# EAGLE design ProtoStar v1 (EAGLE 5.11)
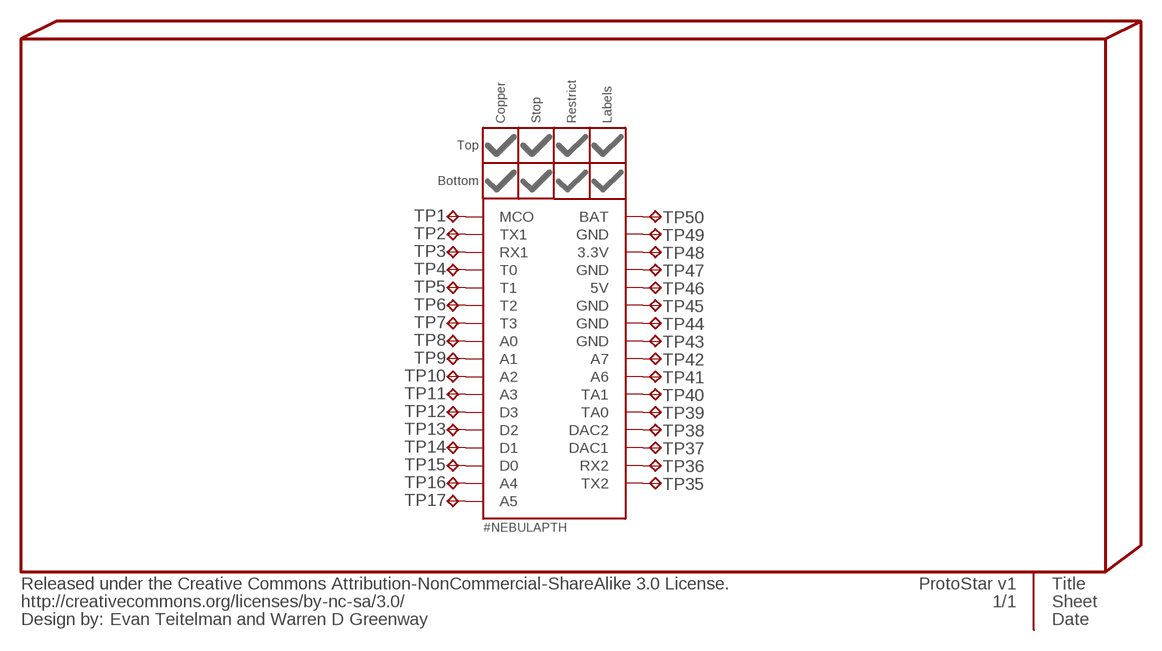
[diagram p0: schematic, sheet 1]

## Parts
FP1  #NEBULAPTH  [#NEBULA-PTH]
INFO2  Evan Teitelman and Warren D Greenway  %CC-NC-SA  [%CC-NC-SA]
TP1  NEBULA-TP  [NEBULA-TP]
TP2  NEBULA-TP  [NEBULA-TP]
TP3  NEBULA-TP  [NEBULA-TP]
TP4  NEBULA-TP  [NEBULA-TP]
TP5  NEBULA-TP  [NEBULA-TP]
TP6  NEBULA-TP  [NEBULA-TP]
TP7  NEBULA-TP  [NEBULA-TP]
TP8  NEBULA-TP  [NEBULA-TP]
TP9  NEBULA-TP  [NEBULA-TP]
TP10  NEBULA-TP  [NEBULA-TP]
TP11  NEBULA-TP  [NEBULA-TP]
TP12  NEBULA-TP  [NEBULA-TP]
TP13  NEBULA-TP  [NEBULA-TP]
TP14  NEBULA-TP  [NEBULA-TP]
TP15  NEBULA-TP  [NEBULA-TP]
TP16  NEBULA-TP  [NEBULA-TP]
TP17  NEBULA-TP  [NEBULA-TP]
TP35  NEBULA-TP  [NEBULA-TP]
TP36  NEBULA-TP  [NEBULA-TP]
TP37  NEBULA-TP  [NEBULA-TP]
TP38  NEBULA-TP  [NEBULA-TP]
TP39  NEBULA-TP  [NEBULA-TP]
TP40  NEBULA-TP  [NEBULA-TP]
TP41  NEBULA-TP  [NEBULA-TP]
TP42  NEBULA-TP  [NEBULA-TP]
TP43  NEBULA-TP  [NEBULA-TP]
TP44  NEBULA-TP  [NEBULA-TP]
TP45  NEBULA-TP  [NEBULA-TP]
TP46  NEBULA-TP  [NEBULA-TP]
TP47  NEBULA-TP  [NEBULA-TP]
TP48  NEBULA-TP  [NEBULA-TP]
TP49  NEBULA-TP  [NEBULA-TP]
TP50  NEBULA-TP  [NEBULA-TP]

## Nets
N$226: FP1.MCO TP1.P$1(TP)
N$227: FP1.COM1_TX(TX1) TP2.P$1(TP)
N$228: FP1.COM1_RX(RX1) TP3.P$1(TP)
N$229: FP1.T0 TP4.P$1(TP)
N$230: FP1.T1 TP5.P$1(TP)
N$231: FP1.T2 TP6.P$1(TP)
N$232: FP1.T3 TP7.P$1(TP)
N$233: FP1.A0 TP8.P$1(TP)
N$234: FP1.A1 TP9.P$1(TP)
N$235: FP1.A2 TP10.P$1(TP)
N$236: FP1.A3 TP11.P$1(TP)
N$237: FP1.D3 TP12.P$1(TP)
N$238: FP1.D2 TP13.P$1(TP)
N$239: FP1.D1 TP14.P$1(TP)
N$240: FP1.D0 TP15.P$1(TP)
N$241: FP1.A4 TP16.P$1(TP)
N$242: FP1.A5 TP17.P$1(TP)
N$243: FP1.COM2_TX(TX2) TP35.P$1(TP)
N$244: FP1.COM2_RX(RX2) TP36.P$1(TP)
N$245: FP1.DAC1 TP37.P$1(TP)
N$246: FP1.DAC2 TP38.P$1(TP)
N$247: FP1.TA0 TP39.P$1(TP)
N$248: FP1.TA1 TP40.P$1(TP)
N$249: FP1.A6 TP41.P$1(TP)
N$250: FP1.A7 TP42.P$1(TP)
N$251: FP1.GND5(GND) TP43.P$1(TP)
N$252: FP1.GND4(GND) TP44.P$1(TP)
N$253: FP1.GND3(GND) TP45.P$1(TP)
N$254: FP1.5V TP46.P$1(TP)
N$255: FP1.GND2(GND) TP47.P$1(TP)
N$256: FP1.3.3V TP48.P$1(TP)
N$257: FP1.GND1(GND) TP49.P$1(TP)
N$258: FP1.BAT TP50.P$1(TP)

## Library data of the parts
FP1 = PygmyBoards:#NEBULA: Nebula Board and Shield Footprint Pads This is the only absolutely required part for the footprint. The parts in "#NEBULA-PART" are merely aesthetic. A circular board outline should be .001" thick and 1.005" in diameter (Reference circle on the Document (48) layer provided).
INFO2 = PygmyBoards:%CC-NC-SA: Released under the Creative Commons Attribution-NonCommercial-ShareAlike 3.0 License. http://creativecommons.org/licenses/by-sa/3.0 Design by: [Designer Name] Change this part's value to change the designer name
TP1-TP17 TP35-TP50 = Pygmy:NEBULA-TP

## Board
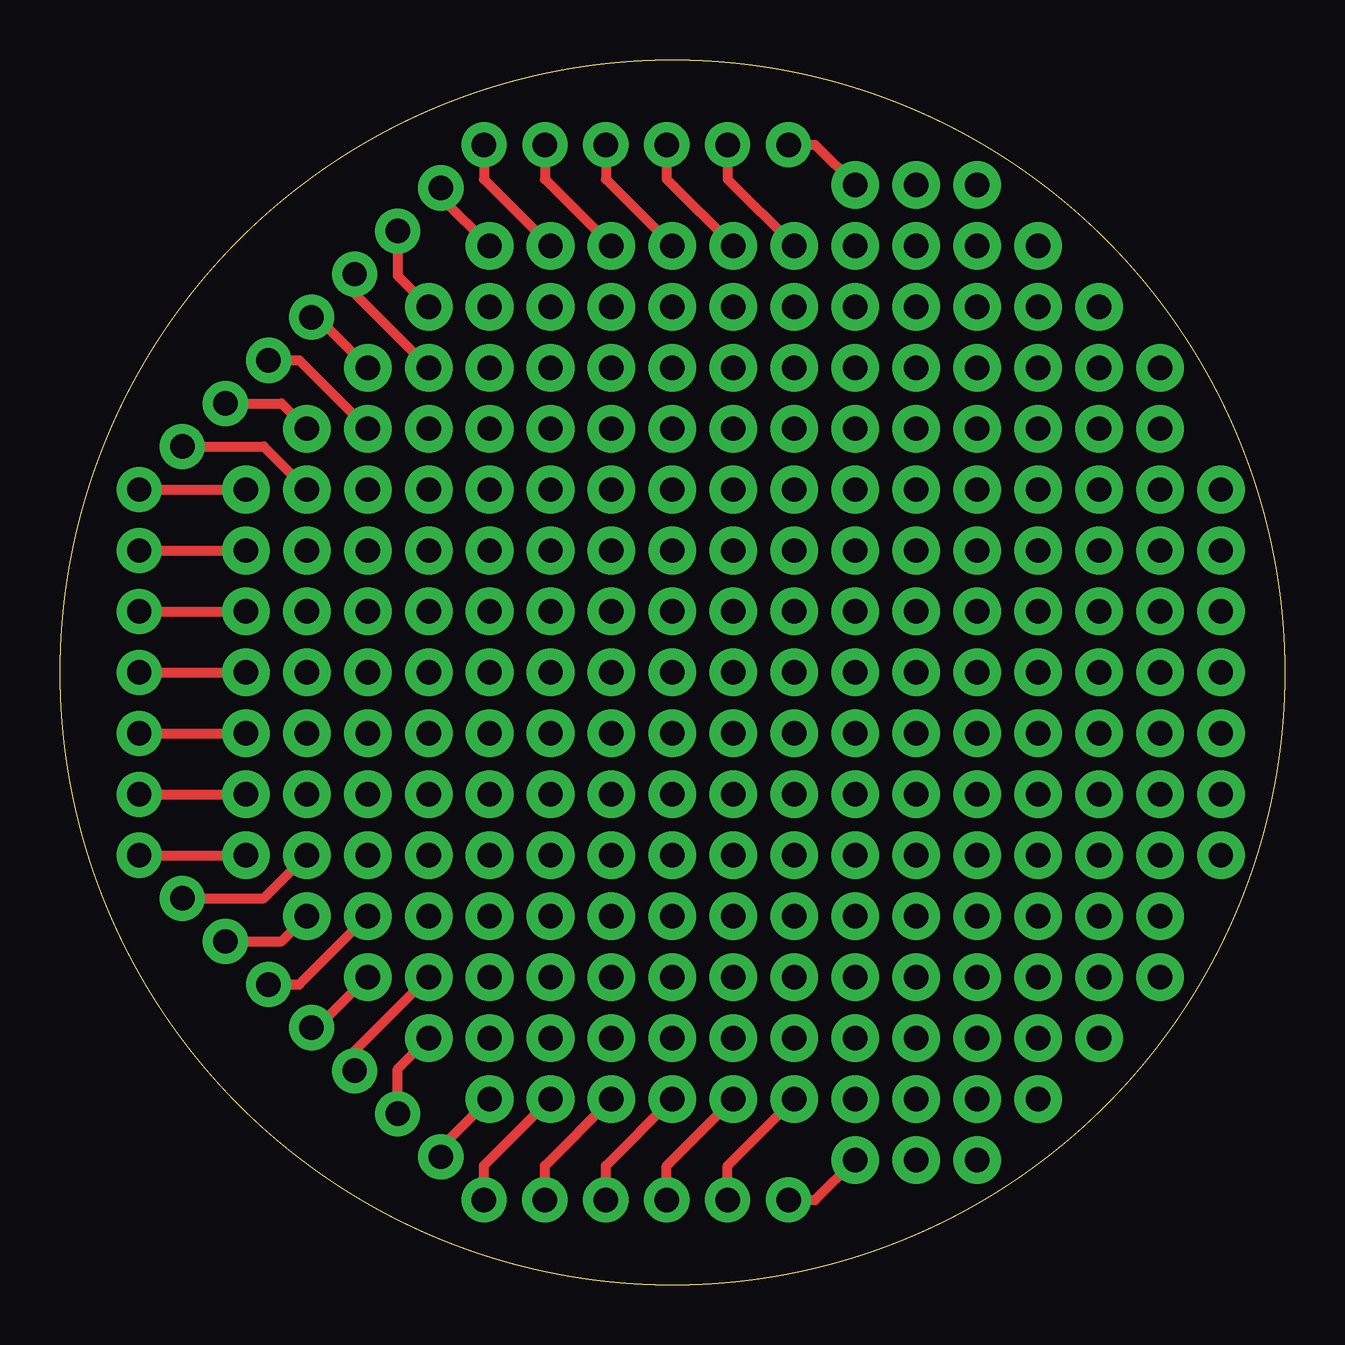
[diagram p1: board, top side]

Size 51.05 x 51.05 mm. Coordinates in mm from the lower left corner, seen from the top.
Outline: circle at 25.53,25.53 radius 25.53
Copper layers (1*16): Top 0.035mm / dielectric 1.5mm / Bottom 0.035mm
Design rules "PDX (Production)": minimum track width 6mil, minimum drill 15mil, track to track 6mil, track to pad 6mil, pad to pad 4mil, via to via 6mil, smd to smd 4mil, copper to edge 15mil, drill to drill 6mil, minimum pad ring 10mil, minimum via ring 8mil, stop-mask expansion 4mil, vias tented up to drill 25mil, thermal gap 10mil

### Footprints (pad centres in the part's own frame; a part is rotated, then mirrored left to right if it is on the bottom)
#NEBULA-PTH = drill 1.016 pad 1.88 round: 3.3V -25.637,-47.388; 5V -30.716,-47.388; A0 -36.848,-7.004; A1 -38.645,-8.8; A2 -40.44,-10.596; A3 -42.237,-12.392; A4 -47.625,-22.86; A5 -47.625,-25.4; A6 -40.44,-40.204; A7 -38.645,-42; BAT -20.557,-47.388; COM1_RX -25.636,-3.412; COM1_TX -23.096,-3.412; COM2_RX -47.625,-30.48; COM2_TX -47.625,-27.94; D0 -47.625,-20.32; D1 -47.625,-17.78; D2 -45.829,-15.984; D3 -44.032,-14.188; DAC1 -47.625,-33.02; DAC2 -45.829,-34.816; GND1 -36.848,-43.796; GND2 -35.052,-45.592; GND3 -33.256,-47.388; GND4 -28.177,-47.388; GND5 -23.097,-47.388; MCO -20.556,-3.412; T0 -28.176,-3.412; T1 -30.716,-3.412; T2 -33.256,-3.412; T3 -35.052,-5.208; TA0 -44.032,-36.612; TA1 -42.237,-38.408
NEBULA-TP = drill 1.016 pad 1.981 round: P$1 0,0

### Placement (x,y rotation side)
FP1  50.93,50.93 0 top
INFO2  -2.41,-10.03 0 top  (outside the outline)
TP1  33.15,45.85 0 top
TP2  30.61,43.31 0 top
TP3  28.07,43.31 0 top
TP4  25.53,43.31 0 top
TP5  22.99,43.31 0 top
TP6  20.45,43.31 0 top
TP7  17.91,43.31 0 top
TP8  15.37,40.77 0 top
TP9  15.37,38.23 0 top
TP10  12.83,38.23 0 top
TP11  12.83,35.69 0 top
TP12  10.29,35.69 0 top
TP13  10.29,33.15 0 top
TP14  7.75,33.15 0 top
TP15  7.75,30.61 0 top
TP16  7.75,28.07 0 top
TP17  7.75,25.53 0 top
TP35  7.75,22.99 0 top
TP36  7.75,20.45 0 top
TP37  7.75,17.91 0 top
TP38  10.29,17.91 0 top
TP39  10.29,15.37 0 top
TP40  12.83,15.37 0 top
TP41  12.83,12.83 0 top
TP42  15.37,12.83 0 top
TP43  30.61,7.75 0 top
TP44  25.53,7.75 0 top
TP45  20.45,7.75 0 top
TP46  22.99,7.75 0 top
TP47  17.91,7.75 0 top
TP48  28.07,7.75 0 top
TP49  15.37,10.29 0 top
TP50  33.15,5.21 0 top

### Tracks (layer width: path | path; a pad name or v marks a point on that pad's centre or on a via)
N$1  (via drill 1.02 pad 1.98)
  other vias: 40.77,7.75
N$2  (via drill 1.02 pad 1.98)
  other vias: 40.77,10.29
N$3  (via drill 1.02 pad 1.98)
  other vias: 40.77,12.83
N$4  (via drill 1.02 pad 1.98)
  other vias: 40.77,15.37
N$5  (via drill 1.02 pad 1.98)
  other vias: 40.77,17.91
N$6  (via drill 1.02 pad 1.98)
  other vias: 40.77,20.45
N$7  (via drill 1.02 pad 1.98)
  other vias: 40.77,22.99
N$8  (via drill 1.02 pad 1.98)
  other vias: 40.77,25.53
N$9  (via drill 1.02 pad 1.98)
  other vias: 40.77,43.31
N$10  (via drill 1.02 pad 1.98)
  other vias: 40.77,40.77
N$11  (via drill 1.02 pad 1.98)
  other vias: 40.77,38.23
N$12  (via drill 1.02 pad 1.98)
  other vias: 40.77,35.69
N$13  (via drill 1.02 pad 1.98)
  other vias: 40.77,33.15
N$14  (via drill 1.02 pad 1.98)
  other vias: 40.77,30.61
N$15  (via drill 1.02 pad 1.98)
  other vias: 40.77,28.07
N$16  (via drill 1.02 pad 1.98)
  other vias: 38.23,40.77
N$17  (via drill 1.02 pad 1.98)
  other vias: 38.23,38.23
N$18  (via drill 1.02 pad 1.98)
  other vias: 38.23,35.69
N$19  (via drill 1.02 pad 1.98)
  other vias: 38.23,33.15
N$20  (via drill 1.02 pad 1.98)
  other vias: 38.23,30.61
N$21  (via drill 1.02 pad 1.98)
  other vias: 38.23,28.07
N$22  (via drill 1.02 pad 1.98)
  other vias: 38.23,7.75
N$23  (via drill 1.02 pad 1.98)
  other vias: 38.23,10.29
N$24  (via drill 1.02 pad 1.98)
  other vias: 38.23,12.83
N$25  (via drill 1.02 pad 1.98)
  other vias: 38.23,15.37
N$26  (via drill 1.02 pad 1.98)
  other vias: 38.23,17.91
N$27  (via drill 1.02 pad 1.98)
  other vias: 38.23,20.45
N$28  (via drill 1.02 pad 1.98)
  other vias: 38.23,22.99
N$29  (via drill 1.02 pad 1.98)
  other vias: 38.23,25.53
N$30  (via drill 1.02 pad 1.98)
  other vias: 35.69,40.77
N$31  (via drill 1.02 pad 1.98)
  other vias: 35.69,38.23
N$32  (via drill 1.02 pad 1.98)
  other vias: 35.69,35.69
N$33  (via drill 1.02 pad 1.98)
  other vias: 35.69,33.15
N$34  (via drill 1.02 pad 1.98)
  other vias: 35.69,30.61
N$35  (via drill 1.02 pad 1.98)
  other vias: 35.69,5.21
N$36  (via drill 1.02 pad 1.98)
  other vias: 35.69,10.29
N$37  (via drill 1.02 pad 1.98)
  other vias: 35.69,12.83
N$38  (via drill 1.02 pad 1.98)
  other vias: 35.69,15.37
N$39  (via drill 1.02 pad 1.98)
  other vias: 10.29,28.07
N$40  (via drill 1.02 pad 1.98)
  other vias: 35.69,20.45
N$41  (via drill 1.02 pad 1.98)
  other vias: 35.69,22.99
N$42  (via drill 1.02 pad 1.98)
  other vias: 35.69,25.53
N$43  (via drill 1.02 pad 1.98)
  other vias: 35.69,28.07
N$44  (via drill 1.02 pad 1.98)
  other vias: 33.15,40.77
N$45  (via drill 1.02 pad 1.98)
  other vias: 33.15,38.23
N$46  (via drill 1.02 pad 1.98)
  other vias: 33.15,35.69
N$47  (via drill 1.02 pad 1.98)
  other vias: 33.15,33.15
N$48  (via drill 1.02 pad 1.98)
  other vias: 33.15,7.75
N$49  (via drill 1.02 pad 1.98)
  other vias: 33.15,10.29
N$50  (via drill 1.02 pad 1.98)
  other vias: 33.15,12.83
N$51  (via drill 1.02 pad 1.98)
  other vias: 33.15,15.37
N$52  (via drill 1.02 pad 1.98)
  other vias: 33.15,17.91
N$53  (via drill 1.02 pad 1.98)
  other vias: 33.15,20.45
N$54  (via drill 1.02 pad 1.98)
  other vias: 33.15,22.99
N$55  (via drill 1.02 pad 1.98)
  other vias: 33.15,25.53
N$56  (via drill 1.02 pad 1.98)
  other vias: 33.15,30.61
N$57  (via drill 1.02 pad 1.98)
  other vias: 33.15,28.07
N$58  (via drill 1.02 pad 1.98)
  other vias: 10.29,20.45
N$59  (via drill 1.02 pad 1.98)
  other vias: 30.61,38.23
N$60  (via drill 1.02 pad 1.98)
  other vias: 30.61,35.69
N$61  (via drill 1.02 pad 1.98)
  other vias: 25.53,15.37
N$62  (via drill 1.02 pad 1.98)
  other vias: 12.83,17.91
N$63  (via drill 1.02 pad 1.98)
  other vias: 30.61,12.83
N$64  (via drill 1.02 pad 1.98)
  other vias: 30.61,15.37
N$65  (via drill 1.02 pad 1.98)
  other vias: 30.61,17.91
N$66  (via drill 1.02 pad 1.98)
  other vias: 30.61,20.45
N$67  (via drill 1.02 pad 1.98)
  other vias: 30.61,22.99
N$68  (via drill 1.02 pad 1.98)
  other vias: 30.61,25.53
N$69  (via drill 1.02 pad 1.98)
  other vias: 30.61,33.15
N$70  (via drill 1.02 pad 1.98)
  other vias: 30.61,30.61
N$71  (via drill 1.02 pad 1.98)
  other vias: 30.61,28.07
N$72  (via drill 1.02 pad 1.98)
  other vias: 28.07,38.23
N$73  (via drill 1.02 pad 1.98)
  other vias: 28.07,35.69
N$74  (via drill 1.02 pad 1.98)
  other vias: 15.37,15.37
N$75  (via drill 1.02 pad 1.98)
  other vias: 28.07,12.83
N$76  (via drill 1.02 pad 1.98)
  other vias: 28.07,15.37
N$77  (via drill 1.02 pad 1.98)
  other vias: 28.07,17.91
N$78  (via drill 1.02 pad 1.98)
  other vias: 28.07,20.45
N$79  (via drill 1.02 pad 1.98)
  other vias: 28.07,22.99
N$80  (via drill 1.02 pad 1.98)
  other vias: 28.07,25.53
N$81  (via drill 1.02 pad 1.98)
  other vias: 28.07,33.15
N$82  (via drill 1.02 pad 1.98)
  other vias: 28.07,30.61
N$83  (via drill 1.02 pad 1.98)
  other vias: 28.07,28.07
N$84  (via drill 1.02 pad 1.98)
  other vias: 25.53,35.69
N$85  (via drill 1.02 pad 1.98)
  other vias: 25.53,33.15
N$86  (via drill 1.02 pad 1.98)
  other vias: 25.53,30.61
N$87  (via drill 1.02 pad 1.98)
  other vias: 25.53,17.91
N$88  (via drill 1.02 pad 1.98)
  other vias: 25.53,20.45
N$89  (via drill 1.02 pad 1.98)
  other vias: 25.53,22.99
N$90  (via drill 1.02 pad 1.98)
  other vias: 25.53,25.53
N$91  (via drill 1.02 pad 1.98)
  other vias: 25.53,28.07
N$92  (via drill 1.02 pad 1.98)
  other vias: 22.99,35.69
N$93  (via drill 1.02 pad 1.98)
  other vias: 22.99,33.15
N$94  (via drill 1.02 pad 1.98)
  other vias: 22.99,30.61
N$95  (via drill 1.02 pad 1.98)
  other vias: 22.99,28.07
N$96  (via drill 1.02 pad 1.98)
  other vias: 22.99,15.37
N$97  (via drill 1.02 pad 1.98)
  other vias: 22.99,17.91
N$98  (via drill 1.02 pad 1.98)
  other vias: 22.99,20.45
N$99  (via drill 1.02 pad 1.98)
  other vias: 22.99,22.99
N$100  (via drill 1.02 pad 1.98)
  other vias: 22.99,25.53
N$101  (via drill 1.02 pad 1.98)
  other vias: 20.45,35.69
N$102  (via drill 1.02 pad 1.98)
  other vias: 20.45,33.15
N$103  (via drill 1.02 pad 1.98)
  other vias: 20.45,30.61
N$104  (via drill 1.02 pad 1.98)
  other vias: 20.45,28.07
N$105  (via drill 1.02 pad 1.98)
  other vias: 17.91,33.15
N$106  (via drill 1.02 pad 1.98)
  other vias: 20.45,15.37
N$107  (via drill 1.02 pad 1.98)
  other vias: 20.45,17.91
N$108  (via drill 1.02 pad 1.98)
  other vias: 20.45,20.45
N$109  (via drill 1.02 pad 1.98)
  other vias: 20.45,22.99
N$110  (via drill 1.02 pad 1.98)
  other vias: 20.45,25.53
N$111  (via drill 1.02 pad 1.98)
  other vias: 17.91,30.61
N$112  (via drill 1.02 pad 1.98)
  other vias: 17.91,28.07
N$113  (via drill 1.02 pad 1.98)
  other vias: 12.83,28.07
N$114  (via drill 1.02 pad 1.98)
  other vias: 17.91,10.29
N$115  (via drill 1.02 pad 1.98)
  other vias: 15.37,28.07
N$116  (via drill 1.02 pad 1.98)
  other vias: 17.91,15.37
N$117  (via drill 1.02 pad 1.98)
  other vias: 17.91,17.91
N$118  (via drill 1.02 pad 1.98)
  other vias: 17.91,20.45
N$119  (via drill 1.02 pad 1.98)
  other vias: 17.91,22.99
N$120  (via drill 1.02 pad 1.98)
  other vias: 17.91,25.53
N$121  (via drill 1.02 pad 1.98)
  other vias: 12.83,30.61
N$122  (via drill 1.02 pad 1.98)
  other vias: 15.37,30.61
N$123  (via drill 1.02 pad 1.98)
  other vias: 15.37,33.15
N$124  (via drill 1.02 pad 1.98)
  other vias: 17.91,35.69
N$125  (via drill 1.02 pad 1.98)
  other vias: 15.37,35.69
N$126  (via drill 1.02 pad 1.98)
  other vias: 20.45,38.23
N$127  (via drill 1.02 pad 1.98)
  other vias: 22.99,38.23
N$128  (via drill 1.02 pad 1.98)
  other vias: 25.53,38.23
N$129  (via drill 1.02 pad 1.98)
  other vias: 22.99,10.29
N$130  (via drill 1.02 pad 1.98)
  other vias: 25.53,40.77
N$131  (via drill 1.02 pad 1.98)
  other vias: 10.29,25.53
N$132  (via drill 1.02 pad 1.98)
  other vias: 12.83,33.15
N$133  (via drill 1.02 pad 1.98)
  other vias: 35.69,43.31
N$134  (via drill 1.02 pad 1.98)
  other vias: 38.23,43.31
N$135  (via drill 1.02 pad 1.98)
  other vias: 38.23,45.85
N$136  (via drill 1.02 pad 1.98)
  other vias: 35.69,45.85
N$137  (via drill 1.02 pad 1.98)
  other vias: 33.15,43.31
N$138  (via drill 1.02 pad 1.98)
  other vias: 25.53,10.29
N$139  (via drill 1.02 pad 1.98)
  other vias: 28.07,10.29
N$140  (via drill 1.02 pad 1.98)
  other vias: 30.61,10.29
N$141  (via drill 1.02 pad 1.98)
  other vias: 28.07,40.77
N$142  (via drill 1.02 pad 1.98)
  other vias: 30.61,40.77
N$143  (via drill 1.02 pad 1.98)
  other vias: 22.99,40.77
N$144  (via drill 1.02 pad 1.98)
  other vias: 12.83,25.53
N$145  (via drill 1.02 pad 1.98)
  other vias: 15.37,25.53
N$146  (via drill 1.02 pad 1.98)
  other vias: 12.83,22.99
N$147  (via drill 1.02 pad 1.98)
  other vias: 35.69,17.91
N$148  (via drill 1.02 pad 1.98)
  other vias: 15.37,22.99
N$149  (via drill 1.02 pad 1.98)
  other vias: 12.83,20.45
N$150  (via drill 1.02 pad 1.98)
  other vias: 15.37,20.45
N$151  (via drill 1.02 pad 1.98)
  other vias: 15.37,17.91
N$152  (via drill 1.02 pad 1.98)
  other vias: 45.85,38.23
N$153  (via drill 1.02 pad 1.98)
  other vias: 20.45,12.83
N$154  (via drill 1.02 pad 1.98)
  other vias: 22.99,12.83
N$155  (via drill 1.02 pad 1.98)
  other vias: 25.53,12.83
N$156  (via drill 1.02 pad 1.98)
  other vias: 48.39,33.15
N$157  (via drill 1.02 pad 1.98)
  other vias: 48.39,17.91
N$158  (via drill 1.02 pad 1.98)
  other vias: 35.69,7.75
N$159  (via drill 1.02 pad 1.98)
  other vias: 38.23,5.21
N$160  (via drill 1.02 pad 1.98)
  other vias: 45.85,12.83
N$161  (via drill 1.02 pad 1.98)
  other vias: 17.91,40.77
N$163  (via drill 1.02 pad 1.98)
  other vias: 20.45,40.77
N$164  (via drill 1.02 pad 1.98)
  other vias: 10.29,22.99
N$165  (via drill 1.02 pad 1.98)
  other vias: 17.91,38.23
N$170  (via drill 1.02 pad 1.98)
  other vias: 10.29,30.61
N$190  (via drill 1.02 pad 1.98)
  other vias: 17.91,12.83
N$194  (via drill 1.02 pad 1.98)
  other vias: 20.45,10.29
N$199  (via drill 1.02 pad 1.98)
  other vias: 43.31,40.77
N$200  (via drill 1.02 pad 1.98)
  other vias: 43.31,38.23
N$201  (via drill 1.02 pad 1.98)
  other vias: 43.31,35.69
N$202  (via drill 1.02 pad 1.98)
  other vias: 43.31,33.15
N$203  (via drill 1.02 pad 1.98)
  other vias: 43.31,30.61
N$204  (via drill 1.02 pad 1.98)
  other vias: 43.31,28.07
N$205  (via drill 1.02 pad 1.98)
  other vias: 43.31,25.53
N$206  (via drill 1.02 pad 1.98)
  other vias: 43.31,22.99
N$207  (via drill 1.02 pad 1.98)
  other vias: 43.31,20.45
N$208  (via drill 1.02 pad 1.98)
  other vias: 43.31,17.91
N$209  (via drill 1.02 pad 1.98)
  other vias: 43.31,15.37
N$210  (via drill 1.02 pad 1.98)
  other vias: 43.31,12.83
N$211  (via drill 1.02 pad 1.98)
  other vias: 43.31,10.29
N$212  (via drill 1.02 pad 1.98)
  other vias: 45.85,15.37
N$213  (via drill 1.02 pad 1.98)
  other vias: 45.85,17.91
N$214  (via drill 1.02 pad 1.98)
  other vias: 45.85,20.45
N$215  (via drill 1.02 pad 1.98)
  other vias: 45.85,22.99
N$216  (via drill 1.02 pad 1.98)
  other vias: 45.85,25.53
N$217  (via drill 1.02 pad 1.98)
  other vias: 45.85,28.07
N$218  (via drill 1.02 pad 1.98)
  other vias: 45.85,30.61
N$219  (via drill 1.02 pad 1.98)
  other vias: 45.85,33.15
N$220  (via drill 1.02 pad 1.98)
  other vias: 45.85,35.69
N$221  (via drill 1.02 pad 1.98)
  other vias: 48.39,30.61
N$222  (via drill 1.02 pad 1.98)
  other vias: 48.39,28.07
N$223  (via drill 1.02 pad 1.98)
  other vias: 48.39,25.53
N$224  (via drill 1.02 pad 1.98)
  other vias: 48.39,22.99
N$225  (via drill 1.02 pad 1.98)
  other vias: 48.39,20.45
N$226
  Top 0.406: FP1.MCO 31.48,47.52 TP1.P$1
N$227
  Top 0.406: FP1.COM1_TX 27.83,46.08 TP2.P$1
N$228
  Top 0.406: FP1.COM1_RX 25.29,46.08 TP3.P$1
N$229
  Top 0.406: FP1.T0 22.75,46.08 TP4.P$1
N$230
  Top 0.406: FP1.T1 20.21,46.08 TP5.P$1
N$231
  Top 0.406: FP1.T2 17.67,46.08 TP6.P$1
N$232
  Top 0.406: FP1.T3 15.88,45.34 TP7.P$1
N$233
  Top 0.406: FP1.A0 14.08,42.06 TP8.P$1
N$234
  Top 0.406: FP1.A1 12.28,41.31 TP9.P$1
N$235
  Top 0.406: FP1.A2 10.72,40.33 TP10.P$1
N$236
  Top 0.406: FP1.A3 9.98,38.53 TP11.P$1
N$237
  Top 0.406: FP1.D3 9.23,36.74 TP12.P$1
N$238
  Top 0.406: FP1.D2 8.49,34.94 TP13.P$1
N$239
  Top 0.406: FP1.D1 TP14.P$1 | TP14.P$1
N$240
  Top 0.406: FP1.D0 TP15.P$1
N$241
  Top 0.406: FP1.A4 TP16.P$1
N$242
  Top 0.406: FP1.A5 TP17.P$1
N$243
  Top 0.406: FP1.COM2_TX TP35.P$1
N$244
  Top 0.406: FP1.COM2_RX TP36.P$1
N$245
  Top 0.406: FP1.DAC1 TP37.P$1
N$246
  Top 0.406: FP1.DAC2 8.49,16.11 TP38.P$1
N$247
  Top 0.406: FP1.TA0 9.23,14.32 TP39.P$1
N$248
  Top 0.406: FP1.TA1 9.98,12.52 TP40.P$1
N$249
  Top 0.406: FP1.A6 10.72,10.72 TP41.P$1
N$250
  Top 0.406: FP1.A7 12.28,9.74 TP42.P$1
N$251
  Top 0.406: FP1.GND5 27.83,4.97 TP43.P$1
N$252
  Top 0.406: FP1.GND4 22.75,4.97 TP44.P$1
N$253
  Top 0.406: FP1.GND3 17.67,4.97 TP45.P$1
N$254
  Top 0.406: FP1.5V 20.21,4.97 TP46.P$1
N$255
  Top 0.406: FP1.GND2 15.88,5.71 TP47.P$1
N$256
  Top 0.406: FP1.3.3V 25.29,4.97 TP48.P$1
N$257
  Top 0.406: FP1.GND1 14.08,9 TP49.P$1
N$258
  Top 0.406: FP1.BAT 31.48,3.54 TP50.P$1

### Text on the board
Document: Pygmy ProtoStar | Version 1.0 | Standard Grid: 50mil | PTH Grid: 100mil
_tsilk: Pygmy ProtoStar
_bsilk: Design By Evan T | and Warren D G